# EAGLE design sensor2 (EAGLE 5.07)
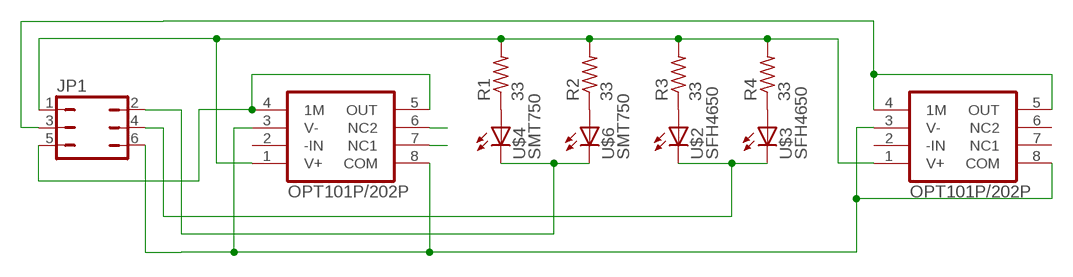
[diagram p0: schematic, sheet 1]

## Parts
JP1  JP3Q  [JP3Q]
R1  33  R-US_R1210  [R1210]
R2  33  R-US_R1210  [R1210]
R3  33  R-US_R1210  [R1210]
R4  33  R-US_R1210  [R1210]
U$1  OPT101P  [DIL08]
U$2  SFH4650  [MIDLED]
U$3  SFH4650  [MIDLED]
U$4  SMT750  [TOPLED]
U$5  OPT101P  [DIL08]
U$6  SMT750  [TOPLED]

## Nets
GND: JP1.6 U$1.3(V-) U$1.8(COM) U$5.3(V-) U$5.8(COM)
N$1: JP1.5 U$5.4(1M) U$5.5(OUT)
N$2: JP1.3 U$1.4(1M) U$1.5(OUT)
N$3: JP1.1 R1.2 R2.2 R3.2 R4.2 U$1.1(V+) U$5.1(V+)
N$4: R2.1 U$6.P$1(A)
N$5: R1.1 U$4.P$1(A)
N$6: R3.1 U$2.P$1(A)
N$7: R4.1 U$3.P$1(A)
N$8: JP1.2 U$4.P$2(C) U$6.P$2(C)
N$9: JP1.4 U$2.P$2(C) U$3.P$2(C)
N$88: U$5.6(NC2)
N$99: U$5.7(NC1)
Unconnected: U$1.2(-IN) U$1.7(NC1) U$5.2(-IN)

## Power pins joined to a net without a drawn wire
NC2: U$1.6(NC2)

## Library data of the parts
JP1 = jumper:JP3Q: JUMPER
R1-R4 = resistor:R-US_: RESISTOR, American symbol
U$1 U$5 = wlib_new:OPT101P
U$2 U$3 = IRLED:SFH4650
U$4 U$6 = IRLED:SMT750

## Board
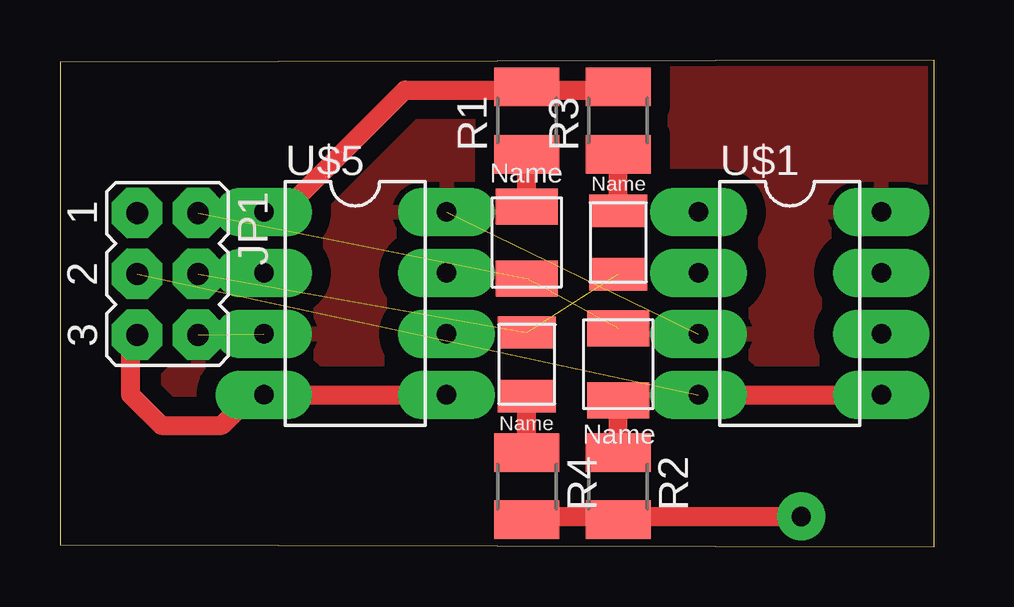
[diagram p1: board, top side]
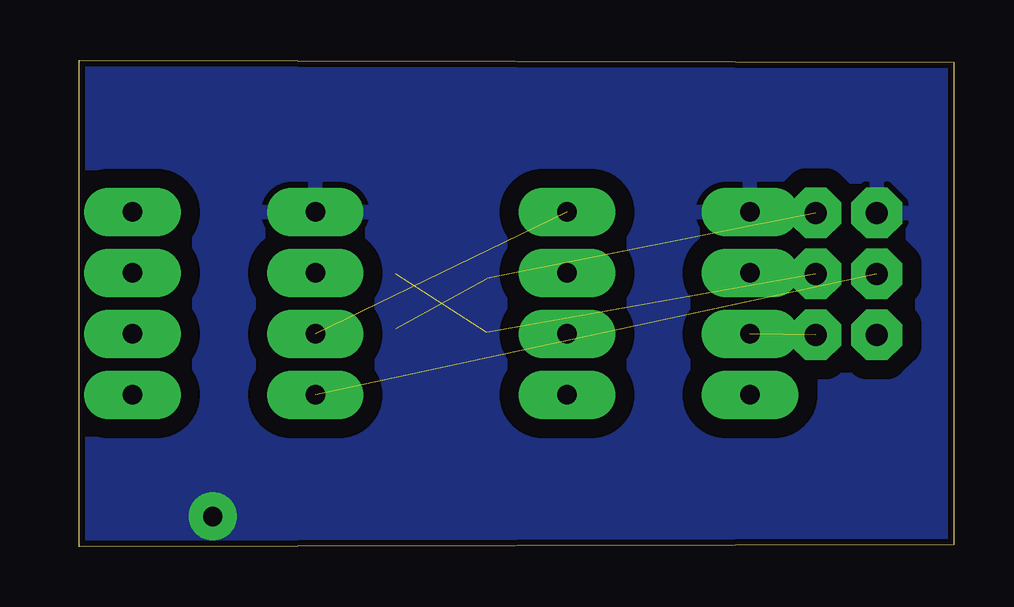
[diagram p2: board, bottom side, seen from below]

Size 36.43 x 20.31 mm. Coordinates in mm from the lower left corner, seen from the top.
Outline: 0,0.1 36.43,0 36.43,20.31 0,20.21 0,0.1
Copper layers (1*16): Top 0.035mm / dielectric 1.5mm / Bottom 0.035mm
Design rules "FJ043CWRTMEP27Y3QS": minimum track width 0.8mm, minimum drill 0.8mm, track to track 0.8mm, track to pad 0.8mm, pad to pad 0.45mm, via to via 0.8mm, smd to smd 8mil, copper to edge 10mil, drill to drill 8mil, minimum pad ring 0.6mm, minimum via ring 0.6mm, stop-mask expansion 0mil, vias tented up to drill 0mil, thermal gap 10mil

### Footprints (pad centres in the part's own frame; a part is rotated, then mirrored left to right if it is on the bottom)
JP3Q = drill 0.914 octagon: 1 -2.54,-1.27; 2 -2.54,1.27; 3 0,-1.27; 4 0,1.27; 5 2.54,-1.27; 6 2.54,1.27
R1210 = smd 1.6 x 2.7: 1 -1.4,0; 2 1.4,0
DIL08 = drill 0.813 long: 1 -3.81,-3.81; 2 -1.27,-3.81; 3 1.27,-3.81; 4 3.81,-3.81; 5 3.81,3.81; 6 1.27,3.81; 7 -1.27,3.81; 8 -3.81,3.81
MIDLED = smd 2.4 x 1.35: P$1 0,1.325; P$2 0,-1.325
TOPLED = smd 2.6 x 1.5: P$1 0,1.5; P$2 0,-1.5

### Placement (x,y rotation side)
JP1  4.48,11.39 270 top
R1  19.45,17.78 90 top
R2  23.26,2.54 270 top
R3  23.26,17.78 90 top
R4  19.45,2.54 270 top
U$1  30.41,10.16 270 top
U$2  23.26,12.7 0 top
U$3  19.45,7.62 180 top
U$4  19.45,12.7 0 top
U$5  12.3,10.16 270 top
U$6  23.26,7.62 180 top

### Tracks (layer width: path | path; a pad name or v marks a point on that pad's centre or on a via)
GND  (2 unrouted)
  pour Top: -0.59,20.62 36.81,20.62 36.81,-0.18 -0.79,-0.18
N$1
  Top 0.8: U$5.5 15.64,6.35 9.29,6.35 U$5.4 8.02,6.35 6.75,5.08 4.21,5.08 2.94,6.35 2.94,8.89 JP1.5
N$2  (1 unrouted)
  Top 0.8: U$1.4 27.07,6.35 33.42,6.35 U$1.5
N$3  (via drill 0.8)
  Top 0.8: 19.45,19.05 23.26,19.05 R3.2 | 19.45,19.05 R1.2 19.45,19.05 | 23.26,1.27 19.45,1.27 R4.2 | 23.26,1.27 R2.2 23.26,1.27 | 23.26,1.27 v30.88,1.27 | 19.45,19.05 14.37,19.05 9.29,13.97 U$5.1
  pour Bottom: -0.59,20.72 36.81,20.62 36.81,-0.18 -0.79,-0.18
N$4
  Top 0.8: R2.1 23.26,3.81 R2.1 | R2.1 U$6.P$1 | U$6.P$1 23.26,6.35 U$6.P$1
N$5
  Top 0.8: R1.1 19.45,16.51 R1.1 | U$4.P$1 R1.1 | U$4.P$1 19.45,13.97 U$4.P$1
N$6
  Top 0.8: R3.1 23.26,16.51 R3.1 | U$2.P$1 R3.1 | U$2.P$1 23.26,13.97 U$2.P$1
N$7
  Top 0.8: R4.1 19.45,3.81 R4.1 | R4.1 U$3.P$1 | U$3.P$1 19.45,6.35 U$3.P$1
N$8  (2 unrouted)
N$9  (2 unrouted)